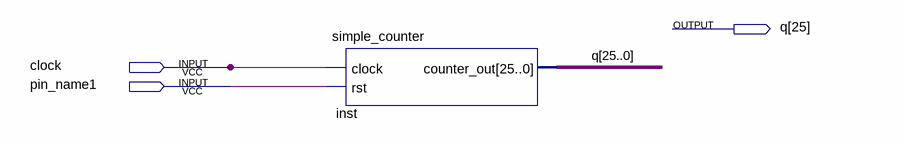
[diagram p0: schematic sheet]
// Quartus schematic Computer.bdf as structural Verilog: 1 symbols, 3 pins
module Computer (
  input  clock,
  input  pin_name1,
  output [25:0] q
);

  simple_counter inst (.clock(clock), .rst(pin_name1), .counter_out(q));
endmodule
